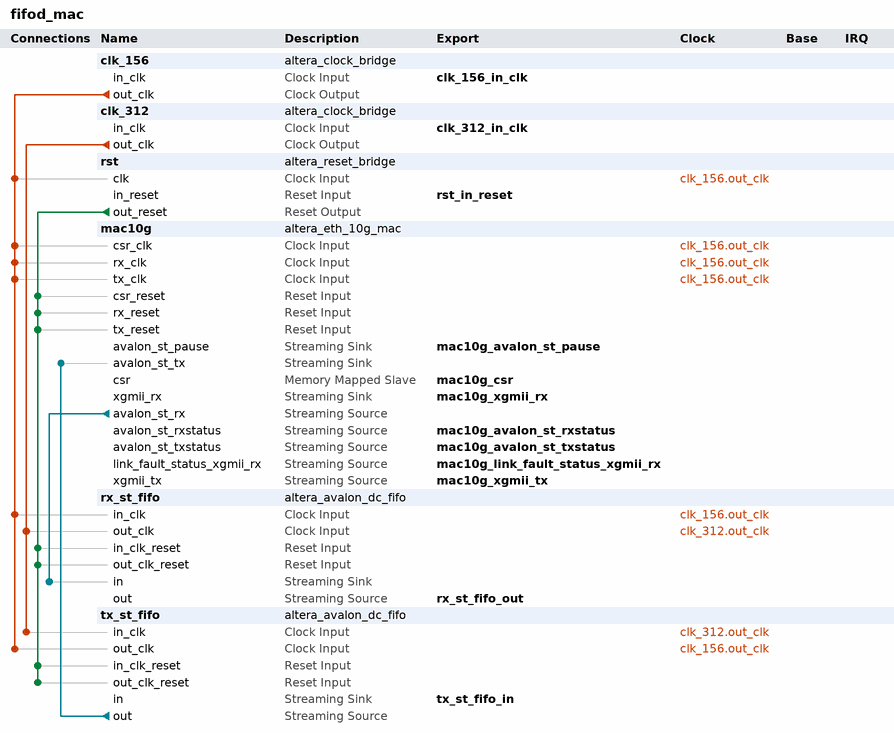
[diagram p0: system contents]
# Platform Designer (Qsys) system fifod_mac, Stratix V 5SGXEA7N2F45C2
# Parameters at their usual value, and those the tool derives, are not listed.
package require -exact qsys 16.1
create_system fifod_mac
set_project_property DEVICE_FAMILY {Stratix V}
set_project_property DEVICE 5SGXEA7N2F45C2

add_instance clk_156 altera_clock_bridge 16.1
set_instance_parameter_value clk_156 DERIVED_CLOCK_RATE 0
set_instance_parameter_value clk_156 EXPLICIT_CLOCK_RATE 156250000

add_instance clk_312 altera_clock_bridge 16.1
set_instance_parameter_value clk_312 DERIVED_CLOCK_RATE 0
set_instance_parameter_value clk_312 EXPLICIT_CLOCK_RATE 312500000

add_instance rst altera_reset_bridge 16.1
set_instance_parameter_value rst ACTIVE_LOW_RESET 0
set_instance_parameter_value rst SYNCHRONOUS_EDGES deassert

add_instance mac10g altera_eth_10g_mac 16.1
set_instance_parameter_value mac10g DATAPATH_OPTION 3
set_instance_parameter_value mac10g ENABLE_1G10G_MAC 0
set_instance_parameter_value mac10g ENABLE_PFC 0
set_instance_parameter_value mac10g ENABLE_PTP_1STEP 0
set_instance_parameter_value mac10g ENABLE_SUPP_ADDR 1
set_instance_parameter_value mac10g ENABLE_TIMESTAMPING 0
set_instance_parameter_value mac10g ENABLE_UNIDIRECTIONAL 0
set_instance_parameter_value mac10g INSTANTIATE_STATISTICS 1
set_instance_parameter_value mac10g INSTANTIATE_TX_CRC 1
set_instance_parameter_value mac10g PFC_PRIORITY_NUM 8
set_instance_parameter_value mac10g PREAMBLE_PASSTHROUGH 0
set_instance_parameter_value mac10g REGISTER_BASED_STATISTICS 0
set_instance_parameter_value mac10g TSTAMP_FP_WIDTH 4

add_instance rx_st_fifo altera_avalon_dc_fifo 16.1
set_instance_parameter_value rx_st_fifo BITS_PER_SYMBOL 8
set_instance_parameter_value rx_st_fifo ERROR_WIDTH 6
set_instance_parameter_value rx_st_fifo FIFO_DEPTH 16
set_instance_parameter_value rx_st_fifo SYMBOLS_PER_BEAT 8
set_instance_parameter_value rx_st_fifo USE_PACKETS 1

add_instance tx_st_fifo altera_avalon_dc_fifo 16.1
set_instance_parameter_value tx_st_fifo BITS_PER_SYMBOL 8
set_instance_parameter_value tx_st_fifo ERROR_WIDTH 1
set_instance_parameter_value tx_st_fifo FIFO_DEPTH 16
set_instance_parameter_value tx_st_fifo SYMBOLS_PER_BEAT 8
set_instance_parameter_value tx_st_fifo USE_PACKETS 1

# connections
add_connection clk_156.out_clk mac10g.csr_clk clock
add_connection clk_156.out_clk mac10g.rx_clk clock
add_connection clk_156.out_clk mac10g.tx_clk clock
add_connection clk_156.out_clk rst.clk clock
add_connection clk_156.out_clk rx_st_fifo.in_clk clock
add_connection clk_156.out_clk tx_st_fifo.out_clk clock
add_connection clk_312.out_clk rx_st_fifo.out_clk clock
add_connection clk_312.out_clk tx_st_fifo.in_clk clock
add_connection rst.out_reset mac10g.csr_reset reset
add_connection rst.out_reset mac10g.rx_reset reset
add_connection rst.out_reset mac10g.tx_reset reset
add_connection rst.out_reset rx_st_fifo.in_clk_reset reset
add_connection rst.out_reset rx_st_fifo.out_clk_reset reset
add_connection rst.out_reset tx_st_fifo.in_clk_reset reset
add_connection rst.out_reset tx_st_fifo.out_clk_reset reset
add_connection mac10g.avalon_st_rx rx_st_fifo.in avalon_streaming
add_connection tx_st_fifo.out mac10g.avalon_st_tx avalon_streaming

# exported interfaces
add_interface clk_156_in_clk clock sink
set_interface_property clk_156_in_clk EXPORT_OF clk_156.in_clk
add_interface clk_312_in_clk clock sink
set_interface_property clk_312_in_clk EXPORT_OF clk_312.in_clk
add_interface mac10g_avalon_st_pause avalon_streaming sink
set_interface_property mac10g_avalon_st_pause EXPORT_OF mac10g.avalon_st_pause
add_interface mac10g_avalon_st_rxstatus avalon_streaming source
set_interface_property mac10g_avalon_st_rxstatus EXPORT_OF mac10g.avalon_st_rxstatus
add_interface mac10g_avalon_st_txstatus avalon_streaming source
set_interface_property mac10g_avalon_st_txstatus EXPORT_OF mac10g.avalon_st_txstatus
add_interface mac10g_csr avalon slave
set_interface_property mac10g_csr EXPORT_OF mac10g.csr
add_interface mac10g_link_fault_status_xgmii_rx avalon_streaming source
set_interface_property mac10g_link_fault_status_xgmii_rx EXPORT_OF mac10g.link_fault_status_xgmii_rx
add_interface mac10g_xgmii_rx avalon_streaming sink
set_interface_property mac10g_xgmii_rx EXPORT_OF mac10g.xgmii_rx
add_interface mac10g_xgmii_tx avalon_streaming source
set_interface_property mac10g_xgmii_tx EXPORT_OF mac10g.xgmii_tx
add_interface rst_in_reset reset sink
set_interface_property rst_in_reset EXPORT_OF rst.in_reset
add_interface rx_st_fifo_out avalon_streaming source
set_interface_property rx_st_fifo_out EXPORT_OF rx_st_fifo.out
add_interface tx_st_fifo_in avalon_streaming sink
set_interface_property tx_st_fifo_in EXPORT_OF tx_st_fifo.in

set_interconnect_requirement {$system} qsys_mm.clockCrossingAdapter HANDSHAKE
set_interconnect_requirement {$system} qsys_mm.enableEccProtection FALSE
set_interconnect_requirement {$system} qsys_mm.insertDefaultSlave FALSE
set_interconnect_requirement {$system} qsys_mm.maxAdditionalLatency 1

save_system fifod_mac.qsys
